# Altium schematic sheet Beaglebone Led Cape.SchDoc
size A4
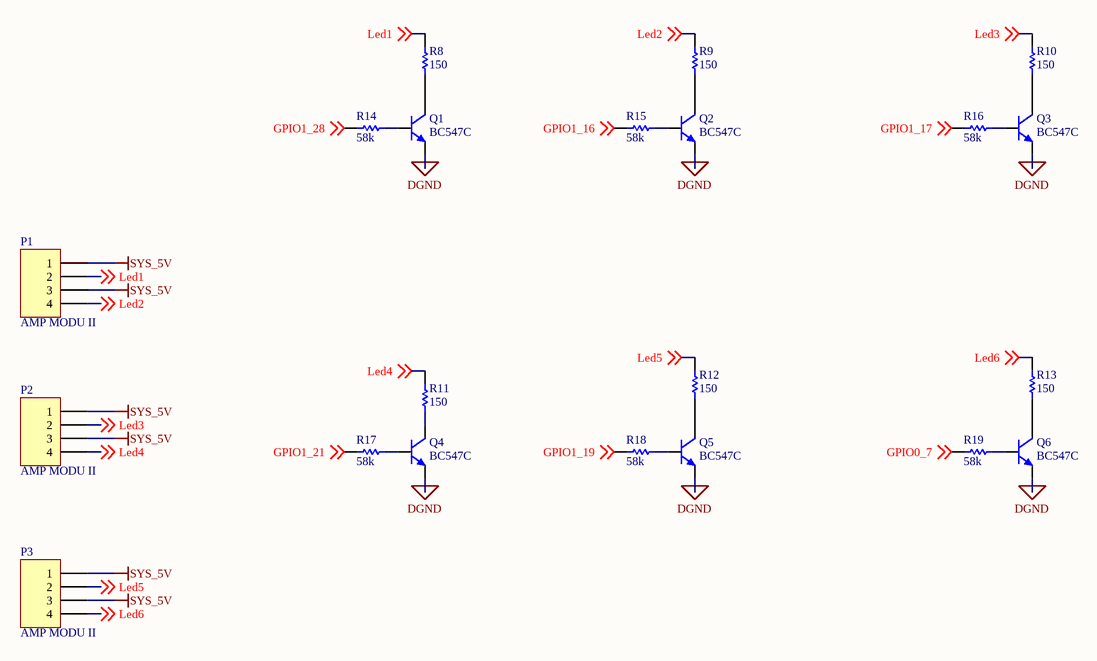
[diagram p0: Beaglebone Led Cape.SchDoc]

## Parts
P1  AMP MODU II  [MHDR1X4]
P2  AMP MODU II  [MHDR1X4]
P3  AMP MODU II  [MHDR1X4]
Q1  BC547C  [SOT-23B_N]
Q2  BC547C  [SOT-23B_N]
Q3  BC547C  [SOT-23B_N]
Q4  BC547C  [SOT-23B_N]
Q5  BC547C  [SOT-23B_N]
Q6  BC547C  [SOT-23B_N]
R8  150  [6-0805_N]
R9  150  [6-0805_N]
R10  150  [6-0805_N]
R11  150  [6-0805_N]
R12  150  [6-0805_N]
R13  150  [6-0805_N]
R14  58k  [6-0805_N]
R15  58k  [6-0805_N]
R16  58k  [6-0805_N]
R17  58k  [6-0805_N]
R18  58k  [6-0805_N]
R19  58k  [6-0805_N]

## Nets
DGND: Q1.3(E) Q2.3(E) Q3.3(E) Q4.3(E) Q5.3(E) Q6.3(E)
SYS_5V: P1.1 P1.3 P2.1 P2.3 P3.1 P3.3
GPIO0_7: R19.1 ; off-sheet GPIO0_7
GPIO1_16: R15.1 ; off-sheet GPIO1_16
GPIO1_17: R16.1 ; off-sheet GPIO1_17
GPIO1_19: R18.1 ; off-sheet GPIO1_19
GPIO1_21: R17.1 ; off-sheet GPIO1_21
GPIO1_28: R14.1 ; off-sheet GPIO1_28
Led1: P1.2 R8.2 ; off-sheet Led1
Led2: P1.4 R9.2 ; off-sheet Led2
Led3: P2.2 R10.2 ; off-sheet Led3
Led4: P2.4 R11.2 ; off-sheet Led4
Led5: P3.2 R12.2 ; off-sheet Led5
Led6: P3.4 R13.2 ; off-sheet Led6
NetQ1_1: Q1.1(C) R8.1
NetQ1_2: Q1.2(B) R14.2
NetQ2_1: Q2.1(C) R9.1
NetQ2_2: Q2.2(B) R15.2
NetQ3_1: Q3.1(C) R10.1
NetQ3_2: Q3.2(B) R16.2
NetQ4_1: Q4.1(C) R11.1
NetQ4_2: Q4.2(B) R17.2
NetQ5_1: Q5.1(C) R12.1
NetQ5_2: Q5.2(B) R18.2
NetQ6_1: Q6.1(C) R13.1
NetQ6_2: Q6.2(B) R19.2

## Library data of the parts
P1-P3 = MHDR1X4: Header, 4-Pin; LatestRevisionDate: 17-Jul-2002; LatestRevisionNote: Re-released for DXP Platform.; Publisher: Altium Limited
Q1-Q6 = QNPN: NPN Bipolar Transistor; Published: 8-Jun-2000; LatestRevisionDate: 29-May-2009; LatestRevisionNote: IPC-7351 Footprint Added.; PackageVersion: Aug-1999; PackageReference: SOT-23B; Publisher: Altium Limited; PackageDescription: 3-Pin SOT-23 Package 0.95 mm Pitch, 2.4 mm Lead Span
R8-R19 = Res1: Resistor; Value: 1K; Published: 8-Jun-2000; LatestRevisionDate: 17-Jul-2002; LatestRevisionNote: Re-released for DXP Platform.; PackageReference: AXIAL-0.3; Publisher: Altium Limited; PackageDescription: Axial Device, Thru-Hole; 2 Leads; 0.3 in Pin Spacing